# EAGLE design motordriver (EAGLE 6.5.0)
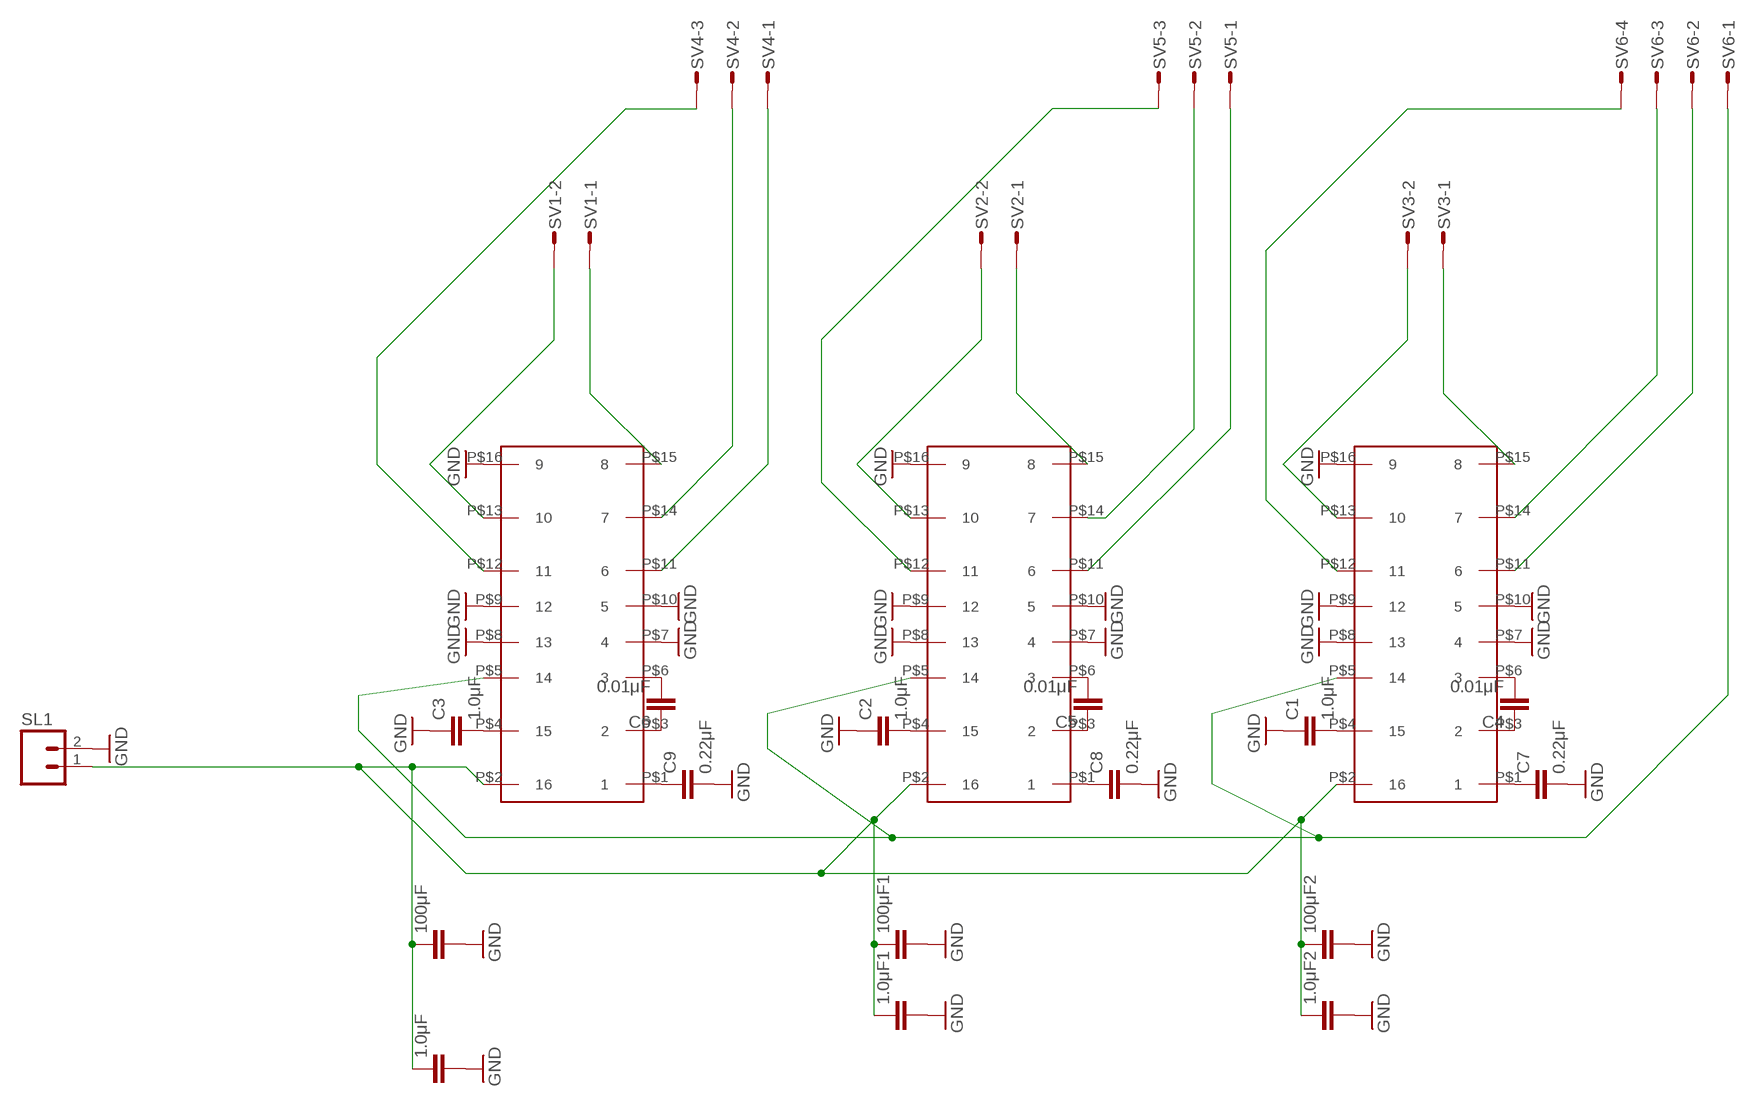
[diagram p0: schematic, sheet 1]

## Parts
1.0μF  C-EU025-024X044  [C025-024X044]
1.0μF1  C-EU025-024X044  [C025-024X044]
1.0μF2  C-EU025-024X044  [C025-024X044]
100μF  C-EU025-024X044  [C025-024X044]
100μF1  C-EU025-024X044  [C025-024X044]
100μF2  C-EU025-024X044  [C025-024X044]
C1  1.0μF  C-EU025-024X044  [C025-024X044]
C2  1.0μF  C-EU025-024X044  [C025-024X044]
C3  1.0μF  C-EU025-024X044  [C025-024X044]
C4  0.01μF  C-EU025-024X044  [C025-024X044]
C5  0.01μF  C-EU025-024X044  [C025-024X044]
C6  0.01μF  C-EU025-024X044  [C025-024X044]
C7  0.22μF  C-EU025-024X044  [C025-024X044]
C8  0.22μF  C-EU025-024X044  [C025-024X044]
C9  0.22μF  C-EU025-024X044  [C025-024X044]
SL1  M02  [02P]
SV1  L02P  [L02P]
SV2  L02P  [L02P]
SV3  L02P  [L02P]
SV4  S03P  [S03P]
SV5  S03P  [S03P]
SV6  S04P  [S04P]
U$1  TB6549PG  [TB6549PG]
U$2  TB6549PG  [TB6549PG]
U$3  TB6549PG  [TB6549PG]

## Nets
GND: 1.0μF1.2 1.0μF2.2 1.0μF.2 100μF1.2 100μF2.2 100μF.2 C1.1 C2.1 C3.1 C7.2 C8.2 C9.2 SL1.2 U$1.P$7 U$1.P$8 U$1.P$9 U$1.P$10 U$1.P$16 U$2.P$7 U$2.P$8 U$2.P$9 U$2.P$10 U$2.P$16 U$3.P$7 U$3.P$8 U$3.P$9 U$3.P$10 U$3.P$16
N$1: SV1.2 U$1.P$13
N$2: SV1.1 U$1.P$15
N$3: SV2.2 U$2.P$13
N$4: SV2.1 U$2.P$15
N$5: SV3.2 U$3.P$13
N$6: SV3.1 U$3.P$15
N$7: SV4.3 U$1.P$12
N$8: SV5.3 U$2.P$12
N$9: C1.2 U$3.P$4
N$10: SV4.2 U$1.P$14
N$11: SV4.1 U$1.P$11
N$12: SV5.2 U$2.P$14
N$13: SV5.1 U$2.P$11
N$14: SV6.3 U$3.P$14
N$15: SV6.2 U$3.P$11
N$16: SV6.1 U$1.P$5 U$2.P$5 U$3.P$5
N$17: C2.2 U$2.P$4
N$18: C3.2 U$1.P$4
N$19: C4.1 U$3.P$3
N$21: C4.2 U$3.P$6
N$22: C5.1 U$2.P$3
N$23: C5.2 U$2.P$6
N$24: C6.1 U$1.P$3
N$25: C6.2 U$1.P$6
N$26: C7.1 U$3.P$1
N$27: C8.1 U$2.P$1
N$28: C9.1 U$1.P$1
N$32: SV6.4 U$3.P$12
N$41: 1.0μF1.1 1.0μF2.1 1.0μF.1 100μF1.1 100μF2.1 100μF.1 SL1.1 U$1.P$2 U$2.P$2 U$3.P$2

## Library data of the parts
1.0μF 1.0μF1 1.0μF2 100μF 100μF1 100μF2 C1-C9 = rcl:C-EU: CAPACITOR, European symbol
SL1 = con-amp-quick:M02: AMP QUICK CONNECTOR; OC_FARNELL: unknown; OC_NEWARK: unknown
SV1-SV3 = con-amp-mt:L02P: AMP MT CONNECTOR; OC_FARNELL: unknown; OC_NEWARK: unknown
SV4 SV5 = con-amp-mt:S03P: AMP MT CONNECTOR; OC_FARNELL: unknown; OC_NEWARK: unknown
SV6 = con-amp-mt:S04P: AMP MT CONNECTOR; OC_FARNELL: unknown; OC_NEWARK: unknown
U$1-U$3 = TB6549PG:TB6549PG

## Board
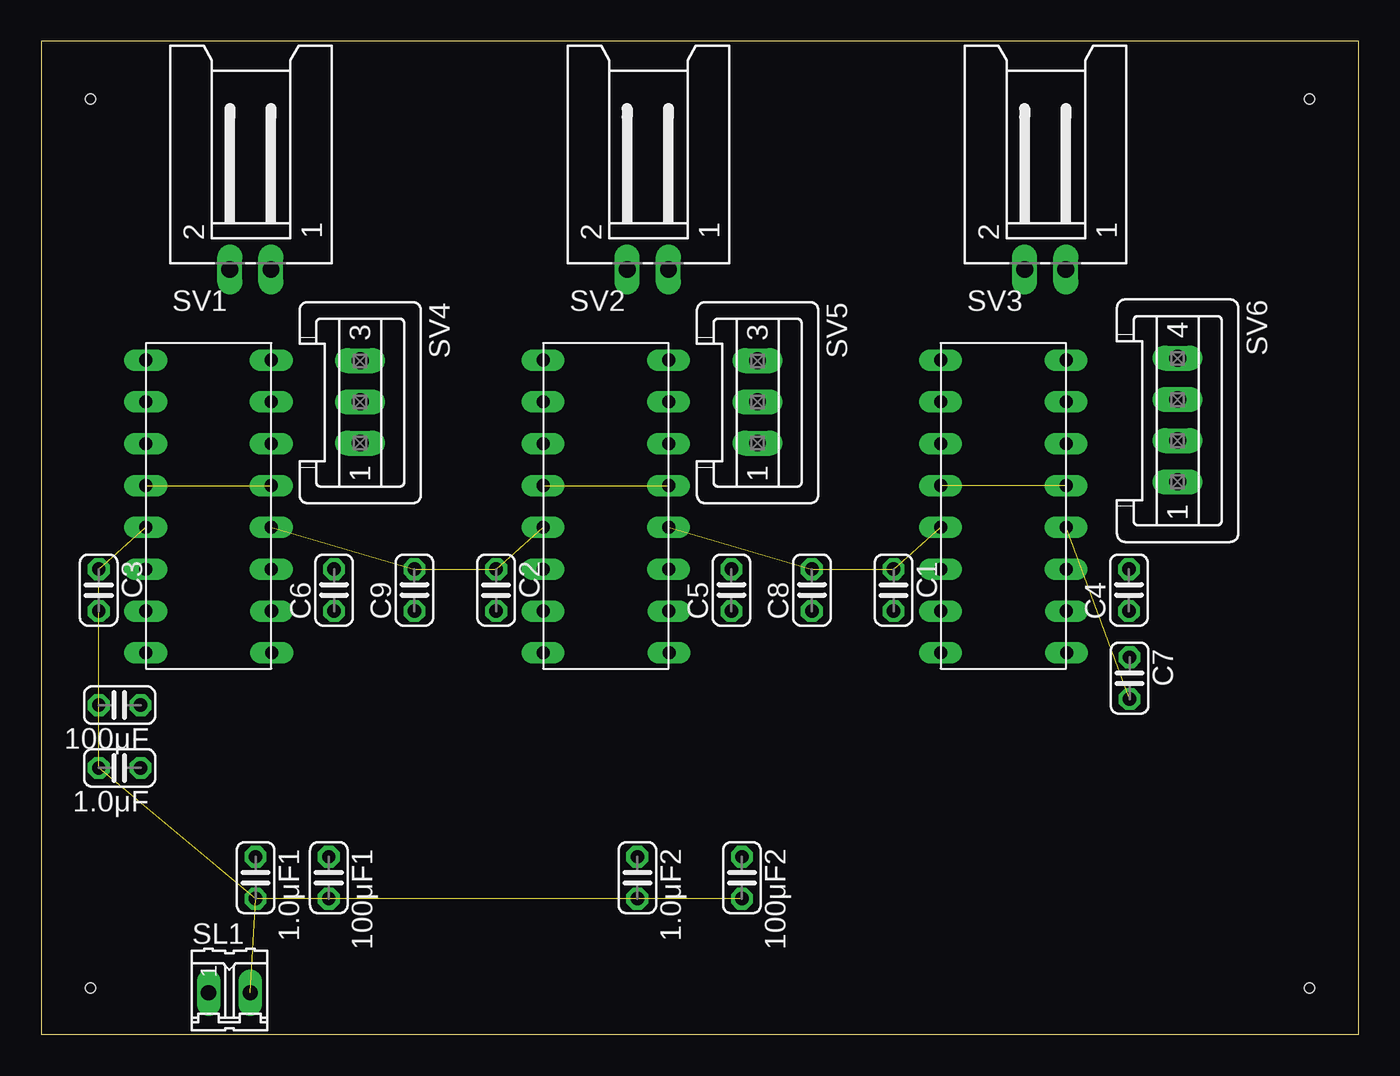
[diagram p1: board, top side]
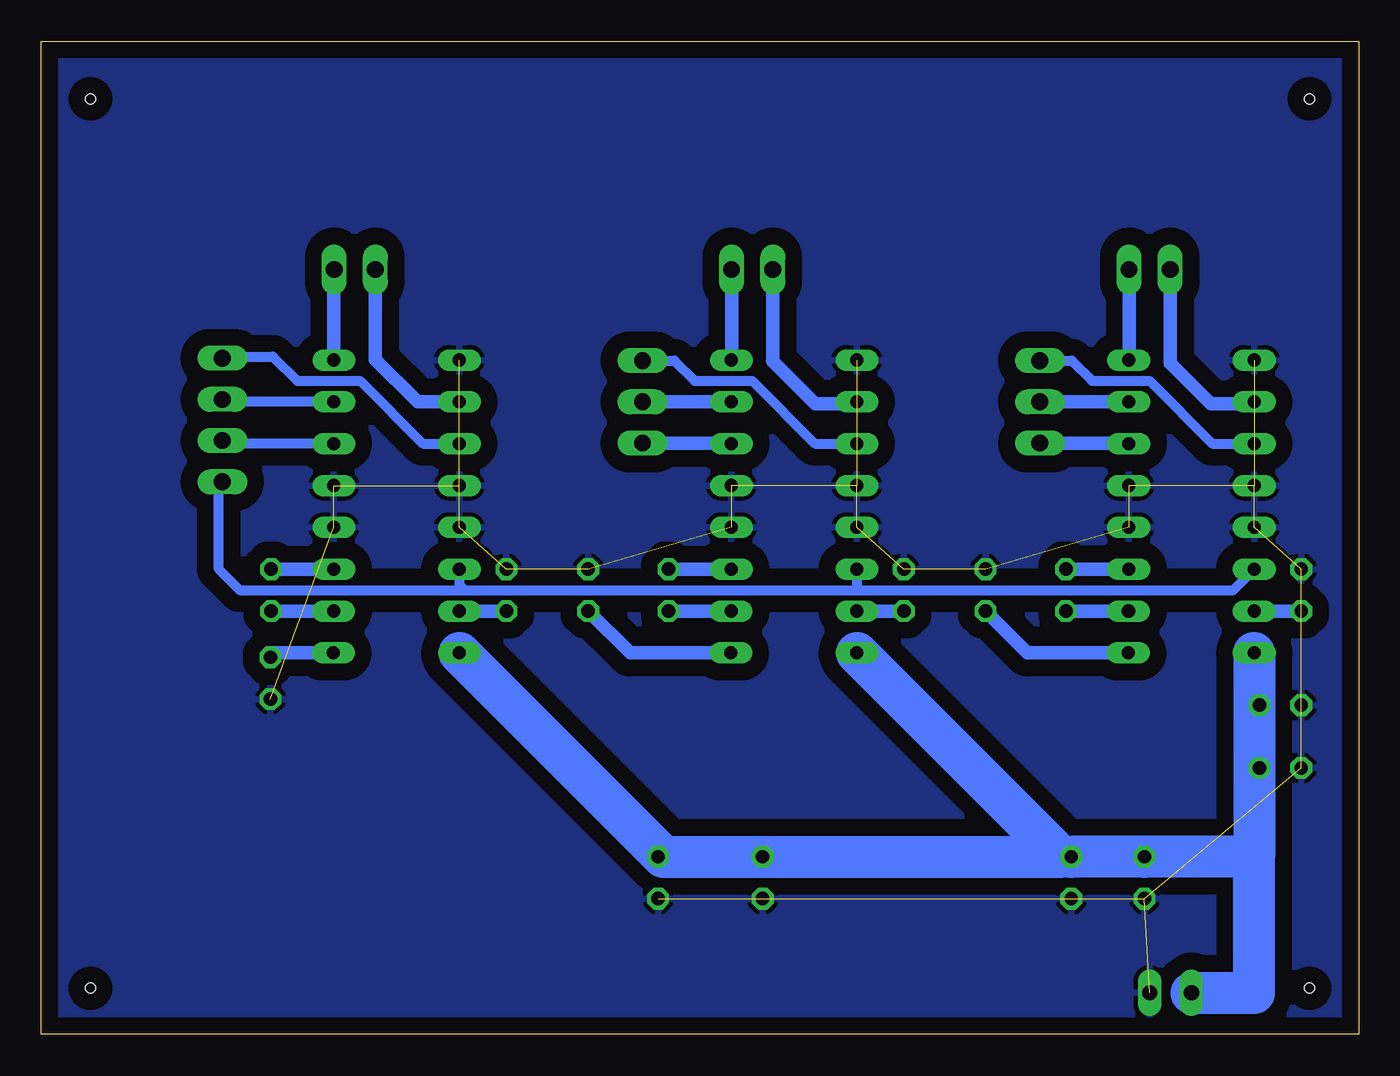
[diagram p2: board, bottom side, seen from below]

Size 80 x 60.31 mm. Coordinates in mm from the lower left corner, seen from the top.
Outline: 0,0 80,0 80,60.31 0,60.31 0,0
Copper layers (1*16): Top 0.035mm / dielectric 1.5mm / Bottom 0.035mm
Design rules "default": minimum track width 10mil, minimum drill 24mil, track to track 8mil, track to pad 8mil, pad to pad 8mil, via to via 8mil, smd to smd 8mil, copper to edge 40mil, drill to drill 8mil, minimum pad ring 10mil, minimum via ring 8mil, stop-mask expansion 4mil, vias tented up to drill 0mil, thermal gap 10mil
Holes 0.6 mm at 3,2.81 77,2.81 77,56.81 3,56.81

### Footprints (pad centres in the part's own frame; a part is rotated, then mirrored left to right if it is on the bottom)
C025-024X044 = drill 0.813 octagon: 1 -1.27,0; 2 1.27,0
02P = drill 0.914 long: 1 -1.27,0; 2 1.27,0
L02P = drill 1.016 long: 1 1.25,-6.25; 2 -1.25,-6.25
S03P = drill 1.016 long: 1 2.5,0; 2 0,0; 3 -2.5,0
S04P = drill 1.016 long: 1 3.75,0; 2 1.25,0; 3 -1.25,0; 4 -3.75,0
TB6549PG = drill 0.8 long: P$1 0.95,-0.03; P$2 0.95,7.62; P$3 3.49,-0.01; P$4 3.49,7.62; P$5 6.03,7.62; P$6 6.03,0; P$7 8.57,0; P$8 8.57,7.62; P$9 11.11,7.62; P$10 11.11,0; P$11 13.65,0; P$12 13.65,7.62; P$13 16.19,7.62; P$14 16.19,0; P$15 18.73,0; P$16 18.73,7.62

### Placement (x,y rotation side)
1.0μF  4.76,16.19 180 top
1.0μF1  13.02,9.52 270 top
1.0μF2  36.2,9.52 270 top
100μF  4.76,20 180 top
100μF1  17.46,9.52 270 top
100μF2  42.55,9.52 270 top
C1  51.75,26.98 270 top
C2  27.62,26.98 270 top
C3  3.49,26.98 270 top
C4  66.04,26.98 90 top
C5  41.91,26.98 90 top
C6  17.78,26.98 90 top
C7  66.08,21.64 270 top
C8  46.79,26.98 90 top
C9  22.66,26.98 90 top
SL1  11.43,2.53 0 top
SV1  12.7,52.7 0 top
SV2  36.83,52.7 0 top
SV3  60.96,52.7 0 top
SV4  19.37,38.41 270 top
SV5  43.5,38.41 270 top
SV6  69,37.31 270 top
U$1  13.97,22.22 90 top
U$2  38.1,22.22 90 top
U$3  62.23,22.22 90 top

### Tracks (layer width: path | path; a pad name or v marks a point on that pad's centre or on a via)
GND  (27 unrouted)
  pour Bottom (isolate 1.016): 0,60.31 80,60.31 80,-0.19 0,-0.19
N$1
  Bottom 0.813: SV1.2 11.45,40.76 9,38.31 6.45,38.31 U$1.P$13
N$2
  Bottom 0.813: SV1.1 13.95,40.97 U$1.P$15
N$3
  Bottom 0.813: SV2.2 35.58,40.89 33,38.31 30.58,38.31 U$2.P$13
N$4
  Bottom 0.813: SV2.1 38.08,40.97 U$2.P$15
N$5
  Bottom 0.813: SV3.2 59.71,40.97 57.15,38.41 U$3.P$13
N$6
  Bottom 0.813: SV3.1 62.23,46.45 U$3.P$15
N$7
  Bottom 0.61: SV4.3 17.42,40.91 16.19,39.68 12.7,39.68 8.89,35.87 U$1.P$12
N$8
  Bottom 0.61: SV5.3 41.55,40.91 40.32,39.68 36.83,39.68 33.02,35.87 U$2.P$12
N$9
  Bottom 0.813: U$3.P$4 C1.2
N$10
  Bottom 0.813: SV4.2 U$1.P$14
N$11
  Bottom 0.813: SV4.1 14.01,35.91 U$1.P$11
N$12
  Bottom 0.813: U$2.P$14 SV5.2
N$13
  Bottom 0.813: SV5.1 38.14,35.91 U$2.P$11
N$14
  Bottom 0.61: U$3.P$14 68.85,38.41 SV6.3
  Bottom 0.813: 62.25,38.39 U$3.P$14
N$15
  Bottom 0.61: U$3.P$11 68.81,35.87 SV6.2
  Bottom 0.813: 62.25,35.89 U$3.P$11
N$16
  Bottom 0.61: 54.29,26.98 67.94,26.98 69.22,28.25 69.22,33.34 SV6.1 | 54.29,26.98 30.48,26.98 | 30.48,26.98 7.62,26.98 U$1.P$5 | U$2.P$5 30.48,26.98 | U$3.P$5 54.61,27.3 54.29,26.98
N$17
  Bottom 0.813: U$2.P$4 C2.2
N$18
  Bottom 0.813: U$1.P$4 C3.2
N$19
  Bottom 0.813: U$3.P$3 C4.1
N$21
  Bottom 0.813: C4.2 U$3.P$6
N$22
  Bottom 0.813: U$2.P$3 C5.1
N$23
  Bottom 0.813: C5.2 U$2.P$6
N$24
  Bottom 0.813: U$1.P$3 C6.1
N$25
  Bottom 0.813: U$1.P$6 C6.2
N$26
  Bottom 0.813: U$3.P$1 65.82,23.17 C7.1
N$27
  Bottom 0.813: U$2.P$1 44.25,23.17 C8.1
N$28
  Bottom 0.813: U$1.P$1 20.12,23.17 C9.1
N$32
  Bottom 0.61: U$3.P$12 56.83,35.87 60.64,39.68 64.45,39.68 65.93,41.16 69.3,41.16 69.15,41.01 68.85,41.01 68.9,41.06 SV6.4
N$41
  Bottom 0.406: U$1.P$2 6.03,22.85 100μF.1 1.0μF.1
  Bottom 1.27: 100μF1.1 18.1,10.79 | 100μF2.1 42.23,10.79
  Bottom 2.54: U$1.P$2 6.35,10.79 | 6.35,10.79 1.0μF1.1 100μF1.1 | U$2.P$2 18.1,10.79 1.0μF2.1 42.23,10.79 U$3.P$2 | SL1.1 6.35,2.53 6.35,10.79